# Altium schematic sheet Sheet1.SCHDOC
size 279 x 215 mm; SheetNumber: 1; SheetTotal: 1; DocumentName: Sheet1.SCHDOC
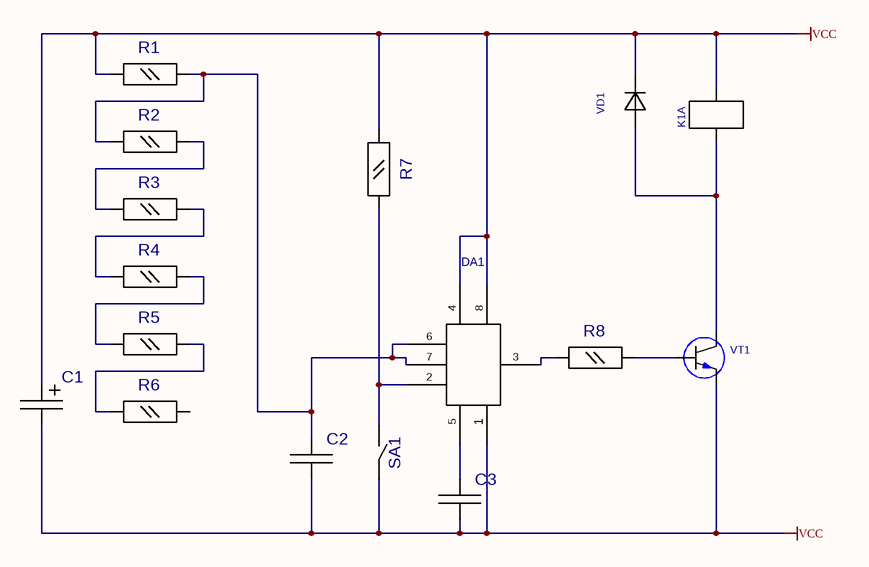
[diagram p0: Sheet1.SCHDOC]

## Parts
C1  CE3528-B  [CE3528-B]  (value not drawn)
C2  CC1812  [CC1812]  (value not drawn)
C3  CC1812  [CC1812]  (value not drawn)
DA1  LMC555  [LMC555]  (value not drawn)
K1  РЭС 49  [RES49]  (value not drawn)  (part A of 2)
R1  C2-33H-0.125W_OLD_UGO  [C2-33H-0.125W]  (value not drawn)
R2  C2-33H-0.125W_OLD_UGO  [C2-33H-0.125W]  (value not drawn)
R3  C2-33H-0.125W_OLD_UGO  [C2-33H-0.125W]  (value not drawn)
R4  C2-33H-0.125W_OLD_UGO  [C2-33H-0.125W]  (value not drawn)
R5  C2-33H-0.125W_OLD_UGO  [C2-33H-0.125W]  (value not drawn)
R6  C2-33H-0.125W_OLD_UGO  [C2-33H-0.125W]  (value not drawn)
R7  C2-33H-0.125W_OLD_UGO  [C2-33H-0.125W]  (value not drawn)
R8  C2-33H-0.125W_OLD_UGO  [C2-33H-0.125W]  (value not drawn)
SA1  8AS9M2RE  [8AS9M2RE]  (value not drawn)
VD1  D-6  [D6]  (value not drawn)
VT1  KT201  [TO-18]  (value not drawn)

## Nets
VCC: C1.1(i/o) C1.2(i/o1) C2.2 C3.2 DA1.1 DA1.4 DA1.8 K1.5 R1.2 R7.2 SA1.2 VD1.2 VT1.2
NetC2_1: C2.1 DA1.6 DA1.7 R1.1 R2.2
NetC3_1: C3.1 DA1.5
NetDA1_2: DA1.2 R7.1 SA1.1
NetDA1_3: DA1.3 R8.2
NetK1_4: K1.4 VD1.1 VT1.1
NetR2_1: R2.1 R3.2
NetR3_1: R3.1 R4.2
NetR4_1: R4.1 R5.2
NetR5_1: R5.1 R6.2
NetR8_1: R8.1 VT1.3

Not connected (* = marked no-connect by the designer): R6 1

## Library data of the parts
R1-R8 = C2-33H-0.125W_OLD_UGO: Autor: pcbdesigner.ru; Value: *
C1 = CE3528-B: Value: *
C2 C3 = CC1812: Value: *
DA1 = LMC555: Value: *
K1 = РЭС 49: Value: *
SA1 = 8AS9M2RE: Value: *; Author: pcbdesigner.ru